# EasyEDA Pro project 小张FOC-STM32G431CBU6.epro, board PCB5_1
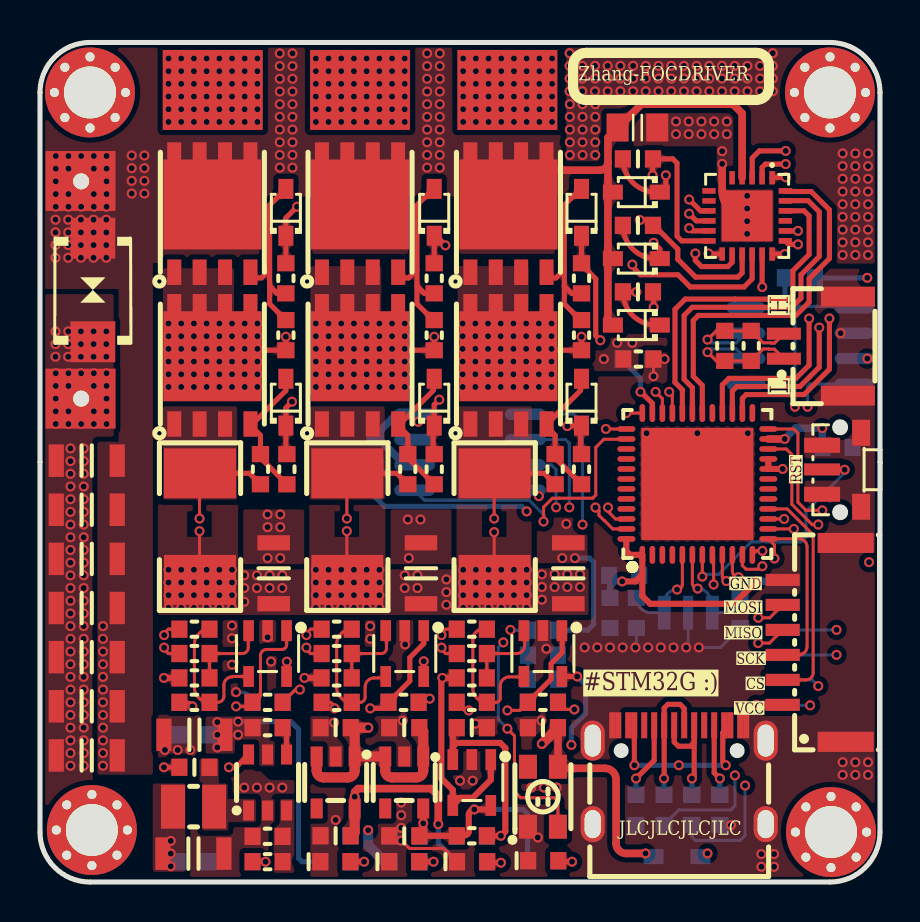
[diagram p11: board, top side]
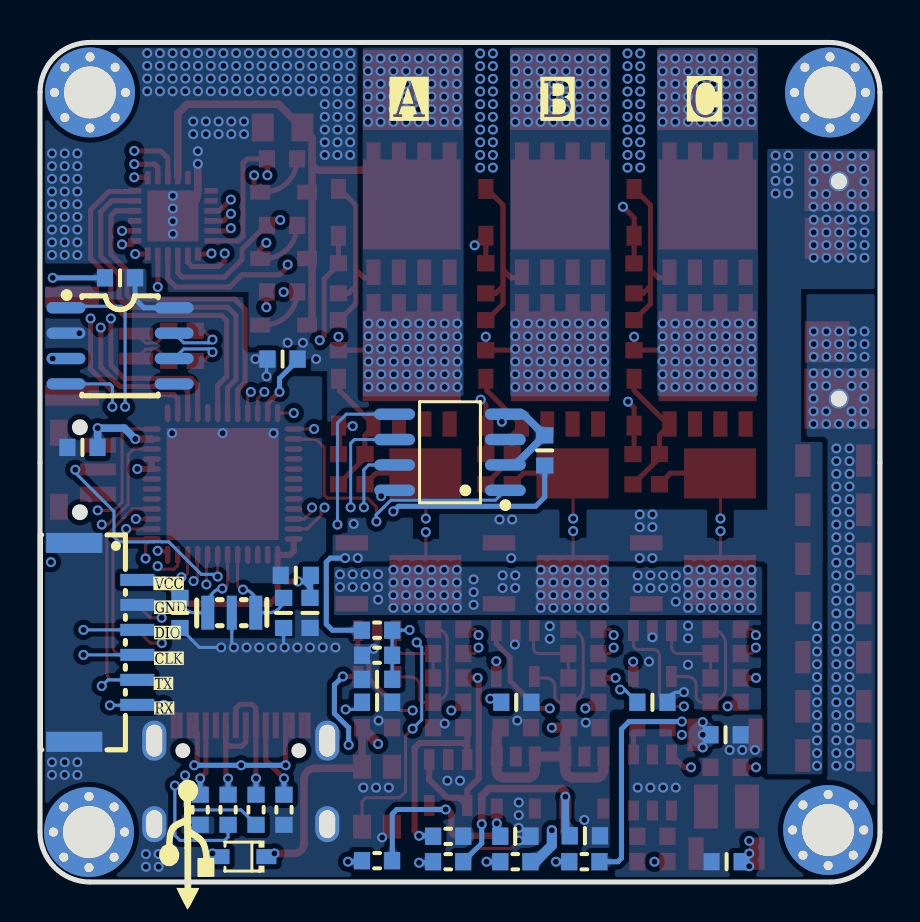
[diagram p12: board, bottom side, seen from below]

Outline 42 x 42 mm; copper layers: Top Layer, Inner1, Inner2, Bottom Layer. Coordinates in mm from the lower left corner of the outline.
Outline path: 0,39.5 0,2.5 arc(0.73,0.73) 2.5,0 39.5,0 arc(41.27,0.73) 42,2.5 42,39.5 arc(41.27,41.27) 39.5,42 2.5,42 arc(0.73,41.27) 0,39.5
Stack: Top Layer 0.035mm 外层铜厚1oz / Dielectric1 0.2104mm 7628 RC49% 8.6mil / Inner1 0.0152mm 内层铜厚 / Dielectric2 1.065mm 1.1mm H/HOZ Copper / Inner2 0.0152mm 内层铜厚 / Dielectric3 0.2104mm 7628 RC49% 8.6mil / Bottom Layer 0.035mm 外层铜厚1oz

## Design rules (mm)
net FDCAN_L: DP1
net FDCAN_H: DP1
net USB-DM: DP3
net USB-DP: DP3
net FDCAN_RX: DP2
net FDCAN_TX: DP2
template: 自定义配置
spacing copperThickness1oz (default): track to track 0.102, other pairs 0.102 to 0.127
spacing copperThickness2oz: track to track 0.203, other pairs 0.152 to 0.3
track width copperThickness1oz (default): min 0.127, default 0.152, max 2.54
track width copperThickness2oz: min 0.203, default 0.254, max 2.54
differential pair differentialPair (default): width min 0.127, default 0.152, max 2.54; gap min 0.152, default 0.152
via viaSize (default): diameter min 0.399, default 0.5, max 10; hole min 0.3, default 0.3, max 6.299

## Placement (name value [footprint] x y rotation side)
C4  100nF  [C0603_SMALL]  7.72 5.74 180 top
C16  10uF  [C1206_SMALL]  19.05 15.44 270 top
C17  10uF  [C1206_SMALL]  26.42 15.44 270 top
C18  10uF  [C1206_SMALL]  2.34 16.17 180 top
C19  10uF  [C1206_SMALL]  2.34 13.71 180 top
C20  10uF  [C1206_SMALL]  2.34 8.79 180 top
C21  10uF  [C1206_SMALL]  2.34 18.62 180 top
C22  10uF  [C1206_SMALL]  2.34 11.25 180 top
C23  10uF  [C1206_SMALL]  2.34 6.33 180 top
C24  10uF  [C1206_SMALL]  2.34 21.08 180 top
C25  10uF  [C1206_SMALL]  11.68 15.44 270 top
C26  100nF  [C0603_SMALL]  7.72 7.37 180 bottom
C30  100nF  [C0603_SMALL]  38 30.23 0 bottom
C31  100nF  [C0603_SMALL]  29.87 26.16 180 bottom
C32  100nF  [C0603_SMALL]  28.5 13.46 90 bottom
C33  100nF  [C0603_SMALL]  29.21 15.34 180 bottom
C34  100nF  [C0603_SMALL]  39.88 21.74 180 bottom
C35  20pF  [C0603_SMALL]  29.82 13.46 270 bottom
C36  20pF  [C0603_SMALL]  35 13.46 90 bottom
C37  1uF  [C0603_SMALL]  29.9 29.53 0 top
C40  1uF  [C0603_SMALL]  29.9 32.85 0 top
C43  1uF  [C0603_SMALL]  29.9 36.18 0 top
C45  1nF  [C0603_SMALL]  11.38 8.99 0 bottom
C46  1nF  [C0603_SMALL]  18.19 8.99 0 bottom
C52  1nF  [C0603_SMALL]  25.15 8.99 0 bottom
C53  1nF  [C0603_SMALL]  25.15 10.14 180 bottom
C54  10nF  [C0603_SMALL]  21.59 7.72 180 top
C59  1uF  [C0603_SMALL]  14.78 7.72 0 top
C60  1uF  [C0603_SMALL]  14.78 2.31 0 top
C61  1uF  [C0603_SMALL]  18.21 7.72 0 top
C62  1uF  [C0603_SMALL]  18.21 2.31 0 top
C64  100nF  [C0603_SMALL]  16.76 21.59 90 bottom
C65  100nF  [C0603_SMALL]  25.15 7.72 180 top
C66  10uF  [C1206_SMALL]  7.72 7.37 180 top
C67  10uF  [C1206_SMALL]  7.67 1.42 0 top
C68  100nF  [C0603_SMALL]  7.67 1.02 0 bottom
C70  10uF  [C0805_SMALL]  29.87 37.74 180 top
C71  100nF  [C0603_SMALL]  14.75 2.31 180 bottom
C72  100nF  [C0603_SMALL]  18.24 2.29 180 bottom
CN5  WAFER-GH1.25-6PWB  [CONN-SMD_6P-P1.25_XUNPU_WAFER-GH1.25-6PWB]  38.71 11.99 90 top
CN6  X1251WRS-02HF-LPSW  [CONN-SMD_2P-P1.25_X1251WRS-02HF-LPSW]  38.8 26.81 90 top
CN7  WAFER-GH1.25-6PWB  [CONN-SMD_6P-P1.25_XUNPU_WAFER-GH1.25-6PWB]  38.71 11.99 270 bottom
D1  SMBJ28CA  [SMB_L4.6-W3.6-LS5.3-BI]  2.64 29.62 270 top
D8  B16WS  [SOD-323_L1.8-W1.3-LS2.5-RD]  29.82 27.86 180 top
D9  B16WS  [SOD-323_L1.8-W1.3-LS2.5-RD]  29.82 31.19 180 top
D10  B16WS  [SOD-323_L1.8-W1.3-LS2.5-RD]  29.82 34.51 180 top
D11  B16WS  [SOD-323_L1.8-W1.3-LS2.5-RD]  12.29 33.5 90 top
D14  B16WS  [SOD-323_L1.8-W1.3-LS2.5-RD]  12.29 24 90 top
D15  B16WS  [SOD-323_L1.8-W1.3-LS2.5-RD]  19.71 24 90 top
D16  B16WS  [SOD-323_L1.8-W1.3-LS2.5-RD]  27.08 24 90 top
D17  B16WS  [SOD-323_L1.8-W1.3-LS2.5-RD]  19.71 33.5 90 top
D18  B16WS  [SOD-323_L1.8-W1.3-LS2.5-RD]  27.08 33.5 90 top
D19  B16WS  [SOD-323_L1.8-W1.3-LS2.5-RD]  31.85 1.27 0 bottom
L1  4.7uH  [IND-SMD_L2.5-W2.0]  7.68 3.77 0 top
L3  NCD0603R1  [LED0603_S]  17.58 1.02 180 top
L4  NCD0603R1  [LED0603_S]  14.14 1.02 180 top
L5  NCD0603R1  [LED0603_S]  24.54 1.07 180 top
L6  NCD0603R1  [LED0603_S]  20.98 1.02 180 top
LED1  XL-3528RGBW-WS2812B  [LED-SMD_4P-L3.5-W2.8-BR-1]  25.15 4.27 270 top
NOREF  -  [Pad_e194]  8.64 39.62 90 top
NOREF#2  -  [Pad_e181]  2.03 24.18 0 top
NOREF#3  -  [Pad_e196]  23.37 39.62 90 top
NOREF#4  -  [Pad_e195]  16 39.62 90 top
NOREF#5  -  [Pad_e1682]  2.06 24.18 0 top
NOREF#6  -  [Pad_e70]  2.06 35.05 0 top
NOREF#7  -  [Pad_e180]  2.03 35.07 0 top
Q7  CSD18540Q5B  [VSON-CLIP-8_L5.0-W6.0-P1.27-BL]  8.62 33.51 0 top
Q8  CSD18540Q5B  [VSON-CLIP-8_L5.0-W6.0-P1.27-BL]  8.62 25.91 0 top
Q9  CSD18540Q5B  [VSON-CLIP-8_L5.0-W6.0-P1.27-BL]  16 33.51 0 top
Q10  CSD18540Q5B  [VSON-CLIP-8_L5.0-W6.0-P1.27-BL]  16 25.91 0 top
Q11  CSD18540Q5B  [VSON-CLIP-8_L5.0-W6.0-P1.27-BL]  23.42 25.91 0 top
Q12  CSD18540Q5B  [VSON-CLIP-8_L5.0-W6.0-P1.27-BL]  23.42 33.51 0 top
R2  52.3kΩ  [R0603_SMALL]  11.38 1.02 0 top
R4  10kΩ  [R0603_SMALL]  11.38 2.29 180 top
R6  62R  [R0603_SMALL]  35.56 26.82 90 top
R7  62R  [R0603_SMALL]  34.24 26.82 90 top
R11  0Ω  [R0603_SMALL]  29.92 26.16 0 top
R14  4.7kΩ  [R0603_SMALL]  33.99 3.62 90 bottom
R15  22Ω  [R0603_SMALL]  31.2 3.61 270 bottom
R16  4.7kΩ  [R0603_SMALL]  29.8 3.61 270 bottom
R17  22Ω  [R0603_SMALL]  32.59 3.61 270 bottom
R20  100kΩ  [R0603_SMALL]  7.72 8.99 0 top
R21  100kΩ  [R0603_SMALL]  14.83 8.99 0 top
R27  22Ω  [R0603_SMALL]  11.38 8.99 180 top
R28  22Ω  [R0603_SMALL]  18.18 8.99 180 top
R29  100kΩ  [R0603_SMALL]  7.72 10.21 180 top
R33  100kΩ  [R0603_SMALL]  21.59 8.99 0 top
R38  22Ω  [R0603_SMALL]  25.15 8.99 180 top
R41  1mΩ  [RES-SMD_L6.4-W3.2_LR2512D-3W-1MR]  8 17.78 90 top
R42  1mΩ  [RES-SMD_L6.4-W3.2_LR2512D-3W-1MR]  15.37 17.78 90 top
R43  1mΩ  [RES-SMD_L6.4-W3.2_LR2512D-3W-1MR]  22.73 17.78 90 top
R44  11kΩ  [R0603_SMALL]  25.15 12.6 0 bottom
R48  1kΩ  [R0603_SMALL]  25.15 11.35 0 bottom
R57  10kΩ  [R0603_SMALL]  21.59 2.29 0 bottom
R59  22Ω  [R0603_SMALL]  12.29 30.2 270 top
R62  10kΩ  [R0603_SMALL]  12.29 27.36 90 top
R67  10kΩ  [R0603_SMALL]  11.02 20.65 90 top
R68  22Ω  [R0603_SMALL]  12.34 20.65 270 top
R71  2kΩ  [R0603_SMALL]  7.72 12.65 0 top
R72  2kΩ  [R0603_SMALL]  7.72 11.43 0 top
R73  100kΩ  [R0603_SMALL]  21.59 10.21 180 top
R74  2kΩ  [R0603_SMALL]  21.59 12.65 0 top
R75  2kΩ  [R0603_SMALL]  21.59 11.43 0 top
R76  100kΩ  [R0603_SMALL]  14.83 10.21 180 top
R77  2kΩ  [R0603_SMALL]  14.83 12.65 0 top
R78  2kΩ  [R0603_SMALL]  14.83 11.43 0 top
R80  10kΩ  [R0603_SMALL]  21.59 2.31 180 top
R81  10kΩ  [R0603_SMALL]  18.39 20.65 90 top
R82  22Ω  [R0603_SMALL]  19.71 20.65 270 top
R83  10kΩ  [R0603_SMALL]  25.76 20.65 90 top
R84  22Ω  [R0603_SMALL]  27.08 20.65 270 top
R85  10kΩ  [R0603_SMALL]  19.71 27.36 90 top
R86  22Ω  [R0603_SMALL]  19.71 30.2 270 top
R87  10kΩ  [R0603_SMALL]  27.08 27.36 90 top
R88  22Ω  [R0603_SMALL]  27.08 30.2 270 top
R90  100kΩ  [R0603_SMALL]  11.38 7.72 0 top
R91  4.7kΩ  [R0603_SMALL]  18.24 1.02 0 bottom
R92  4.7kΩ  [R0603_SMALL]  14.78 1.02 0 bottom
R93  4.7kΩ  [R0603_SMALL]  25.15 1.07 0 bottom
R94  4.7kΩ  [R0603_SMALL]  21.59 1.02 0 bottom
SW1  SKRTLAE010  [KEY-SMD_SKRTLAE010]  40.08 20.62 90 top
TP1  -  [M2.5螺丝孔]  2.5 39.5 0 top
TP2  -  [M2.5螺丝孔]  2.59 2.6 0 top
TP3  -  [M2.5螺丝孔]  39.55 2.5 0 top
TP4  -  [M2.5螺丝孔]  39.5 39.5 0 top
U1  STM32G431CBU6U  [UFQFPN-48_L7.0-W7.0-P0.50-BL-EP5.6]  32.87 19.91 0 top
U2  LP5907QMFX-3.3Q1  [SOT-23-5_L3.0-W1.7-P0.95-LS2.8-BR]  18.21 4.98 90 top
U3  XC6210B332MR  [SOT-23-5_L3.0-W1.7-P0.95-LS2.8-BR]  14.78 4.98 90 top
U4  RY8411  [SOT-23-6_L2.9-W1.6-P0.95-LS2.8-BR]  11.38 4.98 270 top
U5  TJA1050T/CM,118  [SOIC-8_L5.0-W4.0-P1.27-LS6.0-BL]  38 26.82 270 bottom
U7  FD6288Q  [QFN-24_L4.0-W4.0-P0.50-BL-EP2.6]  35.36 33.33 180 top
U12  RS721XF  [TSOT-23-5_L2.9-W1.6-P0.95-LS2.8-BL]  11.38 11.43 180 top
U13  RS721XF  [TSOT-23-5_L2.9-W1.6-P0.95-LS2.8-BL]  18.24 11.43 180 top
U14  RS721XF  [TSOT-23-5_L2.9-W1.6-P0.95-LS2.8-BL]  25.15 11.43 180 top
U16  MT6816CT-ACD  [SOP-8_L5.0-W4.0-P1.27-LS6.0-BL]  21.5 21.5 90 bottom
U17  RS721XF  [TSOT-23-5_L2.9-W1.6-P0.95-LS2.8-BL]  21.59 4.98 180 top
USBC1  TYPE-C-31-M-12  [USB-C_SMD-TYPE-C-31-M-12]  31.96 5.37 0 top
X1  20MHz  [OSC-SMD_3P-L3.2-W1.3-P1.2-L]  32.41 13.47 0 bottom

## Footprints (pads in the part's own frame, mm; a bottom-side part is the same pattern mirrored in y, then rotated)
C0603_SMALL
  rect 0.806x0.864 smd: 1(-0.753,0) 2(0.753,0)
C0805_SMALL
  rect 1.1x1.399 smd: 1(-0.991,0) 2(0.991,0)
C1206_SMALL
  rect 0.762x1.625 smd: 1(-1.524,0) 2(1.524,0)
CONN-SMD_2P-P1.25_X1251WRS-02HF-LPSW
  rect 0.6x1.7 smd: 1(-0.625,1.6) 2(0.625,1.6)
  rect 1x2.7 smd: 3(2.475,-1.6) 4(-2.475,-1.6)
CONN-SMD_6P-P1.25_XUNPU_WAFER-GH1.25-6PWB
  rect 0.6x1.7 smd: 1(-3.125,1.575) 2(-1.875,1.575) 3(-0.625,1.575) 4(0.625,1.575) 5(1.875,1.575) 6(3.125,1.575)
  rect 1x2.8 smd: 7(4.975,-1.575) 8(-4.975,-1.575)
IND-SMD_L2.5-W2.0
  rect 1.2x2.2 smd: 1(1.028,0) 2(-1.028,0)
KEY-SMD_SKRTLAE010
  rect 0.75x1.8 smd: 1(-1.225,0.975) 3(1.225,0.975)
  rect 0.6x1.8 smd: 2(0.015,0.975)
  rect 1.3x0.9 smd: 4(-1.85,-0.975) 5(1.85,-0.975)
LED0603_S
  rect 0.806x0.864 smd: 1(-1.381,-0.001) 2(0.126,-0.001)
LED-SMD_4P-L3.5-W2.8-BR-1
  rect 1.2x0.9 smd: 1(1.5,-0.75) 2(1.5,0.75) 3(-1.5,0.75) 4(-1.5,-0.75)
M2.5螺丝孔
  round 0.635 hole 0.457: (-1.778,0) (-1.257,1.257) (-1.257,-1.257) (0,1.778) (0,-1.778) (1.257,1.257) (1.257,-1.257) (1.778,0)
  round 4.5 hole 2.6: 0(0,0)
OSC-SMD_3P-L3.2-W1.3-P1.2-L
  rect 0.65x1.7 smd: 1(-1.2,0) 3(1.2,0)
  rect 0.5x1.7 smd: 2(0,0)
Pad_e70
  round 1 hole 0.8: 1(0,0)
Pad_e180
  rect 3.5x3 smd: 1(0,0)
Pad_e181
  rect 3.5x3 smd: 2(0,0)
Pad_e194
  rect 4x5 smd: 1(0,0)
Pad_e195
  rect 4x5 smd: 2(0,0)
Pad_e196
  rect 4x5 smd: 3(0,0)
Pad_e1682
  round 1 hole 0.8: 1(0,0)
QFN-24_L4.0-W4.0-P0.50-BL-EP2.6
  rect 0.28x0.665 smd: 1(-1.25,-1.907) 2(-0.75,-1.907) 3(-0.25,-1.907) 4(0.25,-1.907) 5(0.75,-1.907) 6(1.25,-1.907) 13(1.25,1.907) 14(0.75,1.907) 15(0.25,1.907) 16(-0.25,1.907) 17(-0.75,1.907) 18(-1.25,1.907)
  rect 0.665x0.28 smd: 7(1.907,-1.25) 8(1.907,-0.75) 9(1.907,-0.25) 10(1.907,0.25) 11(1.907,0.75) 12(1.907,1.25) 19(-1.907,1.25) 20(-1.907,0.75) 21(-1.907,0.25) 22(-1.907,-0.25) 23(-1.907,-0.75) 24(-1.907,-1.25)
  rect 2.55x2.55 smd: 25(0,0)
R0603_SMALL
  rect 0.806x0.864 smd: 1(-0.753,0) 2(0.753,0)
RES-SMD_L6.4-W3.2_LR2512D-3W-1MR
  rect 2.5x3.6 smd: 1(-2.667,0) 2(2.667,0)
SMB_L4.6-W3.6-LS5.3-BI
  rect 2.047x2.241 smd: 1(-2.591,0) 2(2.591,0)
SOD-323_L1.8-W1.3-LS2.5-RD
  rect 1x0.75 smd: 1(-1.173,0) 2(1.173,0)
SOIC-8_L5.0-W4.0-P1.27-LS6.0-BL
  oval 0.569x1.95 smd: 1(-1.905,-2.705) 2(-0.635,-2.705) 3(0.635,-2.705) 4(1.905,-2.705) 5(1.905,2.705) 6(0.635,2.705) 7(-0.635,2.705) 8(-1.905,2.705)
SOP-8_L5.0-W4.0-P1.27-LS6.0-BL
  oval 0.574x2.035 smd: 1(-1.905,-2.768) 2(-0.635,-2.768) 3(0.635,-2.768) 4(1.905,-2.768) 5(1.905,2.768) 6(0.635,2.768) 7(-0.635,2.768) 8(-1.905,2.768)
SOT-23-5_L3.0-W1.7-P0.95-LS2.8-BR
  rect 1x0.6 smd: 1(1.3,-0.95) 2(1.3,0) 3(1.3,0.95) 4(-1.3,0.95) 5(-1.3,-0.95)
SOT-23-6_L2.9-W1.6-P0.95-LS2.8-BR
  rect 1x0.55 smd: 1(1.4,-0.95) 2(1.4,0) 3(1.4,0.95) 4(-1.4,0.95) 5(-1.4,0) 6(-1.4,-0.95)
TSOT-23-5_L2.9-W1.6-P0.95-LS2.8-BL
  rect 0.532x1.045 smd: 1(-0.95,-1.147) 2(0,-1.147) 3(0.95,-1.147) 4(0.95,1.147) 5(-0.95,1.147)
UFQFPN-48_L7.0-W7.0-P0.50-BL-EP5.6
  oval 0.28x0.9 smd: 1(-2.751,-3.547) 2(-2.251,-3.547) 3(-1.75,-3.547) 4(-1.25,-3.547) 5(-0.75,-3.547) 6(-0.249,-3.547) 7(0.249,-3.547) 8(0.75,-3.547) 9(1.25,-3.547) 10(1.75,-3.547) 11(2.251,-3.547) 12(2.751,-3.547) 25(2.751,3.547) 26(2.251,3.547) 27(1.75,3.547) 28(1.25,3.547) 29(0.75,3.547) 30(0.249,3.547) 31(-0.249,3.547) 32(-0.75,3.547) 33(-1.25,3.547) 34(-1.75,3.547) 35(-2.251,3.547) 36(-2.751,3.547)
  oval 0.9x0.28 smd: 13(3.547,-2.75) 14(3.547,-2.25) 15(3.547,-1.75) 16(3.547,-1.25) 17(3.547,-0.75) 18(3.547,-0.25) 19(3.547,0.25) 20(3.547,0.75) 21(3.547,1.25) 22(3.547,1.75) 23(3.547,2.25) 24(3.547,2.75) 37(-3.547,2.751) 38(-3.547,2.251) 39(-3.547,1.75) 40(-3.547,1.25) 41(-3.547,0.75) 42(-3.547,0.249) 43(-3.547,-0.249) 44(-3.547,-0.75) 45(-3.547,-1.25) 46(-3.547,-1.75) 47(-3.547,-2.251) 48(-3.547,-2.751)
  rect 5.6x5.6 smd: 49(0,0)
USB-C_SMD-TYPE-C-31-M-12
  oval 1.2x2 hole 0.8x1.6: 0(-4.325,1.706) 1(4.325,1.706)
  oval 1.2x1.8 hole 0.8x1.4: 2(4.325,-2.474) 3(-4.325,-2.474)
  rect 0.3x1.3 smd: A1(-3.35,2.474) A4(-2.55,2.474) A5(-1.25,2.474) A6(-0.25,2.474) A7(0.25,2.474) A8(1.25,2.474) A9(2.55,2.474) A12(3.35,2.474) B1(3.05,2.474) B4(2.25,2.474) B5(1.75,2.474) B6(0.75,2.474) B7(-0.75,2.474) B8(-1.75,2.474) B9(-2.25,2.474) B12(-3.05,2.474)
VSON-CLIP-8_L5.0-W6.0-P1.27-BL
  rect 0.7x1.27 smd: 1(-1.904,-3) 2(-0.636,-3) 3(0.636,-3) 4(1.906,-3)
  rect 0.7x1 smd: 5(1.904,3) 6(0.634,3) 7(-0.636,3) 8(-1.906,3)
  rect 4.9x4.5 smd: 8(-0.001,0.39)

## Nets
As in the schematic, except:
12V: C16.1 C17.1 C18.1 C19.1 C20.1 C21.1 C22.1 C23.1 C24.1 C25.1 C26.1 C66.1 C70.2 D1.1 D8.2 D9.2 D10.2 NOREF#6.1 NOREF#7.1 Q7.5 Q7.6 Q7.7 Q7.8 Q9.5 Q9.6 Q9.7 Q9.8 Q12.5 Q12.6 Q12.7 Q12.8 R44.2 R90.1 R92.1 U4.5 U7.4
PGND: C16.2 C17.2 C18.2 C19.2 C20.2 C21.2 C22.2 C23.2 C24.2 C25.2 C26.2 C66.2 C67.2 C68.2 C70.1 D1.2 NOREF#2.2 NOREF#5.1 R4.2 R11.1 R41.1 R42.1 R43.1 R71.1 R74.1 R77.1 U4.2 U7.6 U7.25
SH_A: C37.2 NOREF#3.3 Q11.5 Q11.6 Q11.7 Q11.8 Q12.1 Q12.2 Q12.3 R87.1 U7.18
SH_B: C40.2 NOREF#4.2 Q9.1 Q9.2 Q9.3 Q10.5 Q10.6 Q10.7 Q10.8 R85.1 U7.15
SH_C: C43.2 NOREF.1 Q7.1 Q7.2 Q7.3 Q8.5 Q8.6 Q8.7 Q8.8 R62.1 U7.12

Pads without a net: LED1 4; TP1 0; TP2 0; TP3 0; TP4 0; U1 3 4 17 18 19 25 29 39 40 41 42 43 44 45; U2 4; U3 4; U5 5; U7 5 7 8 21; U16 3; USBC1 A8 B8

## Via types
v1: diameter 0.5, hole 0.299, Top Layer to Bottom Layer, 915 vias

## Routing (per net, layer and track width the routed paths; a pad name or vN(x,y) marks a point on that pad's centre or on a via; arc(x,y) is an arc through that point)
5V: length 96.5
  Top Layer w0.254: R2.1 v1(11.28,1.02)
  Top Layer w0.381: 25.9,7.71 25.9,5.77 arc(25.9,5.77) LED1.3 arc(25.92,5.71) 25.97,5.69 28.25,5.69 arc(28.64,5.53) 28.8,5.13 28.8,1.93 arc(28.95,1.58) 29.3,1.43 v1(30.28,1.43)
  Top Layer w0.508: v1(25.09,6.91) 25.9,7.71 25.9,7.72 ; U3.3 13.83,5.57 arc(13.93,5.33) 14.17,5.23 15.39,5.23 arc(15.63,5.33) 15.73,5.57 U3.1 ; U3.1 U2.3 17.26,5.57 arc(17.36,5.33) 17.6,5.23 18.82,5.23 arc(19.06,5.33) 19.16,5.57 U2.1 19.16,7.53 arc(19.1,7.66) 18.97,7.72 ; U3.1 15.73,7.53 C59.2 v1(16.41,7.72)
  Inner1 w0.305: v1(41.36,26.19) 41.45,26.1 v1(41.45,16)
  Inner2 w0.254: v1(6.54,0.79) 6.78,1.03 11.26,1.03 v1(11.28,1.02) ; v1(41.36,26.19) v1(41.36,30.23)
  Inner2 w0.305: v1(30.28,1.43) 30.84,0.86 34.8,0.86 35.25,1.32 35.25,3.86 35.61,4.22 37.29,4.22 41.45,8.38 v1(41.45,16)
  Inner2 w0.508: v1(25.09,6.91) 16.87,6.91 16.41,6.45 ; 16.41,6.45 v1(16.41,7.72) ; 16.41,6.45 16.41,2.84 arc(16.4,2.72) 16.37,2.6 arc(16.08,2.21) 15.62,2.06 v1(6.54,2.06)
  Bottom Layer w0.254: v1(41.36,30.23) C30.2
  Bottom Layer w0.508: v1(16.41,2.59) 16.41,1.83 17.22,1.02 R91.1
  vias: v1(6.54,1.42)
12V: length 43.9
  Top Layer w0.381: 28.4,36.03 28.4,37.24 30.07,38.91 34.65,38.91 35.11,38.45 U7.4 ; 28.4,36.03 28.4,30.94 ; 28.4,36.03 arc(28.28,35.73) 27.98,35.61 25.22,35.61 arc(23.91,35.07) 23.37,33.76 ; 28.4,30.94 28.4,28.11 arc(28.47,27.93) D8.2 ; 28.4,30.94 arc(28.47,31.12) D9.2
  Bottom Layer w0.254: v1(9.91,8.03) 12.55,8.03 12.93,7.65 12.93,1.2 13.11,1.02 R92.1 ; v1(26.75,16.2) 27.48,16.2 27.69,16 27.69,12.9 27.38,12.6 25.9,12.6
  vias: v1(0.79,36.32) v1(0.79,35.69) v1(0.79,35.05) v1(0.79,34.42) v1(0.79,33.78) v1(0.77,33.13) v1(0.77,32.5) v1(0.77,31.86) v1(0.77,31.23) v1(1.42,36.32) v1(1.42,35.69) v1(1.42,34.42) v1(1.42,33.78) v1(1.41,33.13) v1(1.41,32.5) v1(1.41,31.86) v1(1.41,31.23) v1(2.04,33.13) v1(2.04,32.5) v1(2.04,31.86) v1(2.04,31.23) v1(2.06,36.32) v1(2.06,33.78) v1(2.69,36.32) v1(2.69,35.69) v1(2.69,34.42) v1(2.69,33.78) v1(2.68,33.13) v1(2.68,32.5) v1(2.68,31.86) v1(2.68,31.23) v1(3.15,12.8) v1(3.15,12.17) v1(3.15,11.53) v1(3.15,10.9) v1(3.15,10.26) v1(3.15,9.63) v1(3.15,8.99) v1(3.15,8.36) v1(3.15,7.72) v1(3.15,7.09) v1(3.15,6.45) v1(3.15,5.82) v1(3.33,36.32) v1(3.33,35.69) v1(3.33,35.05) v1(3.33,34.42) v1(3.33,33.78) v1(3.31,33.13) v1(3.31,32.5) v1(3.31,31.86) v1(3.31,31.23) v1(4.59,36.35) v1(4.59,35.71) v1(4.59,35.08) v1(4.59,34.44) v1(5.22,36.35) v1(5.22,35.71) v1(5.22,35.08) v1(5.22,34.44) v1(8.86,8) v1(8.86,7.37) v1(8.86,6.73) v1(9.91,7.37) v1(11.38,18.39) v1(11.38,17.75) v1(11.38,16.2) v1(11.99,41.45) v1(11.99,40.82) v1(11.99,40.18) v1(11.99,39.55) v1(11.99,38.91) v1(11.99,38.28) v1(11.99,37.64) v1(11.99,37.01) v1(11.99,36.37) v1(11.99,35.74) v1(12.01,18.39) v1(12.01,17.75) v1(12.01,16.2) v1(12.62,41.45) v1(12.62,40.82) v1(12.62,40.18) v1(12.62,39.55) v1(12.62,38.91) v1(12.62,38.28) v1(12.62,37.64) v1(12.62,37.01) v1(12.62,36.37) v1(12.62,35.74) v1(18.39,18.14) v1(18.44,16.2) v1(19.02,18.14) v1(19.35,41.45) v1(19.35,40.82) v1(19.35,40.18) v1(19.35,39.55) v1(19.35,38.91) v1(19.35,38.28) v1(19.35,37.64) v1(19.35,37.01) v1(19.35,36.37) v1(19.35,35.74) v1(19.99,41.45) v1(19.99,40.82) v1(19.99,40.18) v1(19.99,39.55) v1(19.99,38.91) v1(19.99,38.28) v1(19.99,37.64) v1(19.99,37.01) v1(19.99,36.37) v1(19.99,35.74) v1(26.11,16.2) v1(26.31,17.91)
AVCC: length 70.4
  Top Layer w0.254: v1(12.34,11.02) 12.34,10.21 ; v1(26.86,10.28) U14.5 ; v1(19.19,11.05) 19.19,10.28
  Top Layer w0.305: v1(37.13,20.66) U1.20 U1.21 ; 22.54,3.63 v1(21.71,3.63) arc(21.52,3.55) 21.44,3.35 21.44,2.54 arc(21.38,2.4) 21.23,2.34 ; U2.5 v1(19.16,2.94) 19.16,2.51 arc(19.1,2.37) 18.97,2.31 20.84,2.31
  Inner2 w0.254: v1(21.71,3.63) 26.24,3.63 26.67,4.06 26.67,6.76 v1(26.57,6.86) ; 17.46,11.02 v1(12.34,11.02) ; 17.46,11.02 17.72,11.28 17.72,19.55 18.85,20.68 37.12,20.68 v1(37.13,20.66) ; 17.46,11.02 19.17,11.02 v1(19.19,11.05) 26.1,11.05 v1(26.86,10.28)
  Bottom Layer w0.254: v1(26.57,6.86) 26.57,7.72 27.28,8.43 27.28,9.86 v1(26.86,10.28) ; v1(21.71,3.63) 24.16,3.63 24.38,3.4 24.38,1.08 R93.1
  Bottom Layer w0.381: C72.1 19.16,2.46 v1(19.16,2.94)
GND: length 31.7
  Top Layer w0.152: v1(18.06,2.07) 18.08,2.07 18.48,1.68 20.19,1.68 20.85,1.02 ; R11.2 v1(30.67,25.3)
  Inner1 w0.254: v1(30.33,22.45) 27.18,19.3 v1(24.94,19.3)
  Inner2 w0.254: v1(24.94,19.3) 24.33,18.69 v1(24.33,18.54)
  Bottom Layer w0.152: C35.2 29.82,11.79 v1(29.77,11.73) ; X1.2 32.41,11.84 v1(32.31,11.73) ; 35,12.71 34.03,11.73 v1(32.94,11.73) ; v1(30.67,25.3) 30.67,26.11 C31.1 ; v1(9.8,9.5) 10.12,9.5 arc(10.48,9.35) C45.1
  Bottom Layer w0.254: C30.1 37.25,29.17 36.8,28.73 U5.8 ; C64.1 16.76,19.25 17.22,18.8 24.08,18.8 v1(24.33,18.54)
  vias: v1(9.6,12.83) v1(9.6,12.19) v1(9.6,10.87) v1(11.38,12.24) v1(11.55,11.03) v1(14.71,7.98) v1(14.78,3.11) v1(16.51,12.8) v1(16.51,12.17) v1(18.14,8.08) v1(18.06,3.98) v1(18.06,3.34) v1(18.06,2.71) v1(18.26,11.88) v1(21,5.07) v1(21.63,5.07) v1(21.77,7.92) v1(24.56,4.72) v1(24.89,2.23) v1(25.07,8.08) v1(25.2,4.72) v1(25.32,11.67) v1(25.83,4.72) v1(27.23,11.73) v1(27.86,11.73) v1(28.5,11.73) v1(29.13,11.73) v1(30.4,11.73) v1(31.04,11.73) v1(31.23,26.16) v1(31.67,11.73) v1(32.87,22.46) v1(34.54,2.84) v1(35.39,22.45) v1(36.07,1.4) v1(36.07,0.76) v1(36.7,1.4) v1(36.7,0.76) v1(40.03,27.46) v1(40.13,5.99) v1(40.13,5.36) v1(40.77,5.99) v1(40.77,5.36) v1(41.4,5.99) v1(41.4,5.36)
PGND: length 38.4
  Top Layer w0.152: v1(6.21,12.35) 6.21,12.44 6.41,12.65 R71.1 ; v1(15.34,17.56) 15.34,15.14 R42.1 ; R77.1 13.52,12.65 13.32,12.44 v1(13.32,12.35) ; v1(7.98,17.56) 7.98,15.14 R41.1 ; R43.1 22.71,15.14 v1(22.71,17.5) ; 20.84,12.65 20.28,12.65 20.07,12.44 v1(20.07,12.35)
  Top Layer w0.381: v1(34.11,35.93) U7.6 34.11,34.57 arc(34.47,33.69) U7.25
  Inner2 w0.152: v1(7.98,17.56) 7.81,17.72 6.21,17.72 5.78,17.29 5.78,12.3 5.89,12.19 6.04,12.19 v1(6.21,12.35) ; v1(22.71,17.5) 22.5,17.72 20.08,17.72 19.65,17.29 19.65,12.3 19.76,12.19 19.91,12.19 v1(20.07,12.35) ; v1(15.34,17.56) 15.18,17.72 13.32,17.72 12.9,17.29 12.9,12.3 13,12.19 13.16,12.19 v1(13.32,12.35)
  vias: v1(0.77,27.55) v1(0.77,26.91) v1(0.77,26.28) v1(0.79,25.45) v1(0.79,24.82) v1(0.79,24.18) v1(0.79,23.55) v1(0.79,22.91) v1(1.41,27.55) v1(1.41,26.91) v1(1.41,26.28) v1(1.42,25.45) v1(1.42,24.82) v1(1.42,23.55) v1(1.42,22.91) v1(1.52,21.69) v1(1.52,21.06) v1(1.52,20.42) v1(1.52,19.79) v1(1.52,19.15) v1(1.52,18.52) v1(1.52,17.88) v1(1.52,17.25) v1(1.52,16.61) v1(1.52,15.98) v1(1.52,15.34) v1(1.52,14.71) v1(1.52,14.07) v1(1.52,13.44) v1(1.52,12.8) v1(1.52,12.17) v1(1.52,11.53) v1(1.52,10.9) v1(1.52,10.26) v1(1.52,9.63) v1(1.52,8.99) v1(1.52,8.36) v1(1.52,7.72) v1(1.52,7.09) v1(1.52,6.45) v1(1.52,5.82) v1(2.04,27.55) v1(2.04,26.91) v1(2.04,26.28) v1(2.06,25.45) v1(2.06,22.91) v1(2.18,21.69) v1(2.18,21.06) v1(2.18,20.42) v1(2.18,19.79) v1(2.18,19.15) v1(2.18,18.52) v1(2.18,17.88) v1(2.18,17.25) v1(2.18,16.61) v1(2.18,15.98) v1(2.18,15.34) v1(2.18,14.71) v1(2.18,14.07) v1(2.18,13.44) v1(2.18,12.8) v1(2.18,12.17) v1(2.18,11.53) v1(2.18,10.9) v1(2.18,10.26) v1(2.18,9.63) v1(2.18,8.99) v1(2.18,8.36) v1(2.18,7.72) v1(2.18,7.09) v1(2.18,6.45) v1(2.18,5.82) v1(2.68,27.55) v1(2.68,26.91) v1(2.68,26.28) v1(2.69,25.45) v1(2.69,24.82) v1(2.69,23.55) v1(2.69,22.91) v1(3.31,27.55) v1(3.31,26.91) v1(3.31,26.28) v1(3.33,25.45) v1(3.33,24.82) v1(3.33,24.18) v1(3.33,23.55) v1(3.33,22.91) v1(6.25,6.6) v1(6.43,15.62) v1(6.43,14.99) v1(6.43,14.35) v1(6.43,13.72) v1(6.88,6.6) v1(7.06,15.62) v1(7.06,14.99) v1(7.06,14.35) v1(7.06,13.72) v1(7.52,6.6) v1(7.7,15.62) v1(7.7,14.99) v1(7.7,14.35) v1(7.7,13.72) v1(8.33,15.62) v1(8.33,14.99) v1(8.33,14.35) v1(8.33,13.72) v1(8.97,15.62) v1(8.97,14.99) v1(8.97,14.35) v1(8.97,13.72) v1(9.6,15.62) v1(9.6,14.99) v1(9.6,14.35) v1(9.6,13.72) v1(10.21,15.34) v1(10.21,14.71) v1(10.21,14.02) v1(10.21,4.72) v1(10.85,15.34) v1(10.85,14.71) v1(10.85,4.72) v1(11.48,15.34) v1(11.48,14.71) v1(11.48,4.72) v1(12.12,15.34) v1(12.12,14.71) v1(12.12,4.72) v1(13.79,15.62) v1(13.79,14.99) v1(13.79,14.35) v1(13.79,13.72) v1(14.43,15.62) v1(14.43,14.99) v1(14.43,14.35) v1(14.43,13.72) v1(15.06,15.62) v1(15.06,14.99) v1(15.06,14.35) v1(15.06,13.72) v1(15.7,15.62) v1(15.7,14.99) v1(15.7,14.35) v1(15.7,13.72) v1(16.33,15.62) v1(16.33,14.99) v1(16.33,14.35) v1(16.33,13.72) v1(16.97,15.62) v1(16.97,14.99) v1(16.97,14.35) v1(16.97,13.72) v1(18.24,15.34) v1(18.24,14.71) v1(18.87,15.34) v1(18.87,14.71) v1(20.32,15.14) v1(20.32,14.5) v1(20.32,13.87) v1(21.16,15.62) v1(21.16,14.99) v1(21.16,14.35) v1(21.16,13.72) v1(21.79,15.62) v1(21.79,14.99) v1(21.79,14.35) v1(21.79,13.72) v1(22.43,15.62) v1(22.43,14.99) v1(22.43,14.35) v1(22.43,13.72) v1(23.06,15.62) v1(23.06,14.99) v1(23.06,14.35) v1(23.06,13.72) v1(23.7,15.62) v1(23.7,14.99) v1(23.7,14.35) v1(23.7,13.72) v1(24.33,15.62) v1(24.33,14.99) v1(24.33,14.35) v1(24.33,13.72) v1(25.09,15.39) v1(25.09,14.76) v1(25.09,14.12) v1(25.73,15.39) v1(25.73,14.76) v1(26.37,15.39) v1(26.37,14.76) v1(26.48,41.47) v1(26.48,40.83) v1(26.48,40.2) v1(26.48,39.56) v1(26.49,38.91) v1(26.49,38.28) v1(26.49,37.64) v1(26.49,37.01) v1(26.49,36.37) v1(27,15.39) v1(27,14.76) v1(27.11,41.47) v1(27.11,40.83) v1(27.11,40.2) v1(27.11,39.56) v1(27.13,38.91) v1(27.13,38.28) v1(27.13,37.64) v1(27.13,37.01) v1(27.13,36.37) v1(27.75,41.47) v1(27.75,40.83) v1(27.75,40.2) v1(27.75,39.56) v1(27.76,38.91) v1(27.76,38.28) v1(27.76,37.64) v1(27.76,37.01) v1(27.76,36.37) v1(28.19,26.16) v1(28.38,41.47) v1(28.38,40.83) v1(28.38,40.2) v1(28.38,39.56) v1(28.85,26.97) v1(29.02,41.47) v1(29.02,40.83) v1(29.02,40.2) v1(29.02,39.56) v1(29.62,26.97) v1(29.65,41.47) v1(29.65,40.83) v1(29.65,40.2) v1(29.65,39.56) v1(30.29,41.47) v1(30.29,40.83) v1(30.29,40.2) v1(30.29,39.56) v1(30.92,41.47) v1(30.92,40.83) v1(30.92,40.2) v1(30.92,39.56) v1(31.56,41.47) v1(31.56,40.83) v1(31.56,40.2) v1(31.56,39.56) v1(31.8,38.05) v1(31.8,37.41) v1(32.19,41.47) v1(32.19,40.83) v1(32.19,40.2) v1(32.19,39.56) v1(32.44,38.05) v1(32.44,37.41) v1(32.83,41.47) v1(32.83,40.83) v1(32.83,40.2) v1(32.83,39.56) v1(33.07,38.05) v1(33.07,37.41) v1(33.46,41.47) v1(33.46,40.83) v1(33.46,40.2) v1(33.46,39.56) v1(33.71,38.05) v1(33.71,37.41) v1(34.1,41.47) v1(34.1,40.83) v1(34.1,40.2) v1(34.1,39.56) v1(34.11,36.56) v1(34.34,38.05) v1(34.34,37.41) v1(34.73,41.47) v1(34.73,40.83) v1(34.73,40.2) v1(34.73,39.56) v1(35.37,41.47) v1(35.37,40.83) v1(35.37,40.2) v1(35.37,39.56) v1(35.36,34.33) v1(35.36,33.69) v1(35.36,33.06) v1(35.36,32.42) v1(36,41.47) v1(36,40.83) v1(36,40.2) v1(36,39.56) v1(36.64,41.47) v1(36.64,40.83) v1(36.64,40.2) v1(36.64,39.56) v1(40.13,36.45) v1(40.13,35.81) v1(40.13,35.18) v1(40.13,34.54) v1(40.13,33.91) v1(40.13,33.27) v1(40.13,32.64) v1(40.13,32) v1(40.13,31.37) v1(40.77,36.45) v1(40.77,35.81) v1(40.77,35.18) v1(40.77,34.54) v1(40.77,33.91) v1(40.77,33.27) v1(40.77,32.64) v1(40.77,32) v1(40.77,31.37) v1(41.4,36.45) v1(41.4,35.81) v1(41.4,35.18) v1(41.4,34.54) v1(41.4,33.91) v1(41.4,33.27) v1(41.4,32.64) v1(41.4,32) v1(41.4,31.37)
VBUS: length 20.5
  Top Layer w0.152: v1(36.12,15.8) 35.97,15.65 35.31,15.65 35.12,15.83 U1.11
  Inner2 w0.152: v1(36.12,15.8) 28.65,15.8 28.5,15.65 28.5,12.85 28.26,12.61 v1(23.52,12.61)
  Bottom Layer w0.152: 24.39,10.19 R44.1 23.53,12.6 v1(23.52,12.61)
VCC: length 109.1
  Top Layer w0.254: 30.02,24.54 30.62,23.95 30.62,23.46
  Top Layer w0.305: 29.32,17.16 29.31,17.15 29.31,16.56 29.51,16.37 U1.1 30.12,15.39 ; v1(35.81,15.04) 34.7,13.92 30.51,13.92 30.12,14.31 30.12,15.39 ; 30.12,15.39 29.77,15.04 v1(29.11,15.04)
  Top Layer w0.381: CN5.1 v1(35.81,8.86) ; v1(19.91,2.9) 19.91,4.32 19.56,4.67 15.9,4.67 15.73,4.51 U3.5 ; U1.23 v1(37.24,22.16)
  Top Layer w0.508: U3.5 15.73,2.51 arc(15.68,2.37) C60.2
  Inner2 w0.254: 35.31,8.36 35.31,14.53 v1(35.81,15.04)
  Inner2 w0.381: 27.99,21.79 36.87,21.79 v1(37.24,22.16) ; 27.99,21.79 25.65,21.79 24.42,23.03 v1(18.91,23.03) ; 27.99,21.79 27.56,22.22 27.56,24.05 27.99,24.49 29.99,24.49 v1(30.02,24.52) ; v1(19.91,2.9) 21.18,1.63 29.41,1.63 30.48,2.69 30.48,7.42 31.09,8.03 34.98,8.03 35.31,8.36 v1(35.81,8.86) 38.25,11.3 38.25,17.42 38.26,17.43 38.26,17.9 38.25,17.91 38.25,18.85 39.12,19.71 v1(39.12,22.71)
  Bottom Layer w0.254: v1(30.02,24.52) 30.02,25.2 29.12,26.1 C31.2 ; 20.84,1.02 19.91,1.94 v1(19.91,2.9)
  Bottom Layer w0.305: C33.2 28.5,15.3 28.5,14.78 ; 28.5,14.78 28.75,15.04 v1(29.11,15.04) ; 28.5,14.78 C32.2 ; v1(18.91,23.03) 18.91,23.23 U16.4
  Bottom Layer w0.381: U16.2 18.24,20.86 C64.2 17.83,23.41 U16.4 ; CN7.1 37.06,15.04 v1(35.81,15.04) ; v1(15.73,4.27) 15.73,2.54 C71.1 ; v1(37.24,22.16) 37.78,22.71 v1(39.12,22.71) 39.12,21.75 C34.2
FDCAN_H: length 6.6
  Top Layer w0.152: CN6.2 36.72,26.96 36.57,26.96 36.56,26.97 36.16,26.97 R6.2 R7.2 33.81,27.58 v1(33.38,27.14)
  Bottom Layer w0.152: U5.7 34.81,26.97 33.54,26.97 v1(33.38,27.14)
FDCAN_L: length 6.6
  Top Layer w0.152: v1(33.38,26.51) 33.81,26.07 35.56,26.07 36.16,26.67 36.43,26.67 36.44,26.65 36.72,26.65 CN6.1
  Bottom Layer w0.152: U5.6 34.81,26.67 33.54,26.67 v1(33.38,26.51)
FDCAN_RX: length 24.9
  Top Layer w0.152: U1.46 28.78,18.16 28.4,18.54 v1(28.4,18.74)
  Inner2 w0.152: v1(28.4,18.74) 28.24,18.9 28.24,19.45 28.35,19.56 30.46,19.56 30.57,19.45 30.57,19.15 30.68,19.05 30.97,19.05 31.08,19.15 31.08,19.45 31.18,19.56 31.48,19.56 31.58,19.45 31.58,19.15 31.69,19.05 31.98,19.05 32.09,19.15 32.09,19.45 32.2,19.56 32.49,19.56 32.6,19.45 32.6,19.15 32.71,19.05 33,19.05 33.11,19.15 33.11,19.45 33.22,19.56 33.51,19.56 33.62,19.45 33.62,19.15 33.72,19.05 34.02,19.05 34.12,19.15 34.12,19.45 34.23,19.56 34.52,19.56 34.63,19.45 34.63,19.15 34.74,19.05 35.03,19.05 35.14,19.15 35.14,19.45 35.25,19.56 35.54,19.56 35.65,19.45 35.65,19.15 35.75,19.05 36.05,19.05 36.16,19.15 36.16,19.45 36.26,19.56 36.56,19.56 36.66,19.45 36.66,19.18 36.77,19.07 37.06,19.07 37.17,19.18 37.17,19.45 37.28,19.56 37.93,19.56 38.21,19.84 38.21,23.61 v1(38.38,23.77)
  Bottom Layer w0.152: U5.4 38.51,24.92 38.38,24.79 v1(38.38,23.77)
FDCAN_TX: length 24.9
  Top Layer w0.152: U1.47 28.64,17.66 28.23,18.08 28.21,18.08 27.95,18.35 27.95,18.56 v1(27.77,18.74)
  Inner2 w0.152: v1(27.77,18.74) 27.93,18.9 27.93,19.58 28.22,19.86 37.8,19.86 37.91,19.97 37.91,23.61 v1(37.74,23.77)
  Bottom Layer w0.152: U5.1 40.63,28.8 37.95,28.8 37.74,28.6 v1(37.74,23.77)
GH_A: length 20.1
  Top Layer w0.254: v1(28.02,27.1) 27.79,27.33 27.79,30.17 27.08,30.89 R88.1 D18.1 ; U7.19 37.44,31.9 v1(37.9,31.9)
  Inner2 w0.254: v1(37.9,31.9) 37.9,28.66 37.49,28.25 29.16,28.25 v1(28.02,27.1)
GH_B: length 19.8
  Top Layer w0.254: 35.61,31.42 35.61,30.17 35.2,29.77 32.51,29.77 31.9,30.38 30.02,30.38 29.62,30.78 v1(29.62,30.89) ; D17.1 19.71,32.31 ; 19.71,32.31 19.81,32.31 v1(20.27,31.85) ; 19.71,32.31 R86.1
  Inner2 w0.254: v1(29.62,30.89) 28.65,31.85 v1(20.27,31.85)
GH_C: length 28.7
  Top Layer w0.254: U7.13 33.45,31.42 v1(33.43,31.44) ; 12.29,30.95 D11.1 12.29,33.22 v1(12.85,33.78)
  Inner2 w0.254: v1(12.85,33.78) 13.77,34.7 33.73,34.7 33.93,34.49 33.93,31.65 33.73,31.44 v1(33.43,31.44)
GL_A: length 18.6
  Top Layer w0.254: 32.47,32.71 32.6,32.57 33.45,32.57 ; 27.03,22.83 27.03,21.45 27.08,21.4 ; 27.03,22.83 D16.1 ; 27.03,22.83 26.39,22.83 v1(26.37,22.81)
  Inner2 w0.254: v1(26.37,22.81) 26.37,29.72 26.77,30.12 29.78,30.12 30.18,30.53 30.18,32.46 30.43,32.71 v1(32.46,32.71)
GL_B: length 27.2
  Top Layer w0.254: v1(32.46,33.43) 32.81,33.08 U7.10 ; R82.1 19.66,21.45 19.66,22.83 ; D15.1 19.71,23.88 v1(19.96,24.13)
  Inner2 w0.254: v1(19.96,24.13) 19.2,24.89 19.2,33.48 19.56,33.83 32,33.83 32.4,33.43 v1(32.46,33.43)
GL_C: length 33.2
  Top Layer w0.254: 32.46,34.14 33.03,33.57 33.45,33.57 ; R68.1 12.29,21.45 D14.1 12.29,23.72 v1(12.6,24.03)
  Inner2 w0.254: v1(12.6,24.03) 13.29,24.72 13.29,33.35 14.17,34.24 32.36,34.24 32.46,34.14
  vias: v1(32.46,34.14)
HIN1: length 17.1
  Top Layer w0.254: 37.26,33.57 37.27,33.58 38.2,33.58 38.46,33.33 38.46,31.39 37.64,30.58 37.64,29.36 37.44,29.16 34.74,29.16 34.74,29.16 32.26,29.16 31.75,28.65 31.75,24.99 32.12,24.63 U1.32
HIN2: length 17.9
  Top Layer w0.254: U7.23 37.28,34.09 38.41,34.09 38.96,33.53 38.96,31.29 38.05,30.38 38.05,29.21 37.59,28.75 32.61,28.75 32.21,28.35 32.21,25.15 32.62,24.73 U1.31
HIN3: length 18.6
  Top Layer w0.254: U1.30 33.12,24.85 32.66,25.3 32.66,28.09 32.92,28.35 37.79,28.35 38.46,29.01 38.46,30.17 39.47,31.19 39.47,33.63 38.56,34.54 37.29,34.54 37.26,34.57
IA: length 17.7
  Top Layer w0.152: 25.9,8.99 26.25,8.63 v1(26.72,8.63) ; U1.10 34.62,15.56 arc(34.71,15.34) v1(34.93,15.25)
  Inner2 w0.152: v1(26.72,8.63) 33.98,8.63 arc(34.63,8.9) 34.9,9.55 34.9,15.22 arc(34.91,15.24) v1(34.93,15.25)
  Bottom Layer w0.152: v1(26.72,8.63) 26.26,8.63 C52.2
IA+: length 16.3
  Top Layer w0.152: R43.2 22.71,20.42 v1(22.71,18.18) ; v1(20.07,11.73) 20.07,11.64 20.28,11.43 20.84,11.43
  Top Layer w0.254: R43.2 25.21,20.45 R83.1
  Inner2 w0.152: v1(20.07,11.73) 19.91,11.89 19.63,11.89 19.35,12.17 19.35,17.42 19.95,18.02 22.55,18.02 v1(22.71,18.18)
IB: length 23.1
  Top Layer w0.152: v1(19.49,9.17) 19.12,9.17 18.93,8.99 ; U1.9 34.12,15.31 arc(34.17,15.14) v1(34.32,15.06)
  Inner2 w0.152: v1(19.49,9.17) 33.51,9.17 arc(34.1,9.42) 34.34,10.01 34.34,15.03 arc(34.33,15.05) v1(34.32,15.06)
  Bottom Layer w0.152: v1(19.49,9.17) 19.12,9.17 C46.2
IB+: length 15.7
  Top Layer w0.152: R78.1 13.52,11.43 13.32,11.64 v1(13.32,11.73) ; v1(15.34,18.18) 15.34,20.42 R42.2
  Top Layer w0.254: R42.2 17.84,20.45 R81.1
  Inner2 w0.152: v1(13.32,11.73) 13.16,11.89 12.88,11.89 12.59,12.17 12.59,17.42 13.2,18.02 15.18,18.02 v1(15.34,18.18)
IC: length 29.5
  Top Layer w0.152: v1(33.68,14.88) 33.68,16.3 33.62,16.37 ; 12.13,8.99 12.77,9.63 v1(12.99,9.63)
  Inner2 w0.152: v1(33.68,14.88) 33.68,10.16 arc(33.52,9.78) 33.15,9.63 v1(12.99,9.63)
  Bottom Layer w0.152: C45.2 12.77,9.63 v1(12.99,9.63)
IC+: length 15.4
  Top Layer w0.152: v1(7.98,18.18) 7.98,20.42 R41.2 ; R72.1 6.41,11.43 6.21,11.64 v1(6.21,11.73)
  Top Layer w0.254: R41.2 10.47,20.45 R67.1
  Inner2 w0.152: v1(7.98,18.18) 7.81,18.02 6.08,18.02 5.48,17.42 5.48,12.17 5.77,11.89 6.04,11.89 v1(6.21,11.73)
LIN1: length 17.3
  Top Layer w0.254: v1(37.29,35.25) 36.63,35.25 36.61,35.23 ; v1(38.46,28.19) 38.46,25.86 37.79,25.2 34.44,25.2 34.12,24.87 U1.28
  Inner2 w0.254: v1(38.46,28.19) 38.46,35.05 38.25,35.25 v1(37.29,35.25)
LIN2: length 19.3
  Top Layer w0.254: v1(38.96,27.74) 38.96,25.76 38,24.79 34.85,24.79 34.62,24.56 U1.27 ; v1(37.29,35.92) 36.27,35.92 36.11,35.75 U7.2
  Inner2 w0.254: v1(38.96,27.74) 38.96,35.56 38.61,35.92 v1(37.29,35.92)
LIN3: length 21.4
  Top Layer w0.254: v1(39.47,28.19) 39.47,25.65 38.2,24.38 35.31,24.38 35.12,24.2 U1.26 ; 35.61,35.23 35.61,35.24 35.61,36.22 35.97,36.58 v1(37.29,36.58)
  Inner2 w0.254: v1(37.29,36.58) 39.06,36.58 39.47,36.17 v1(39.47,28.19)
NRST: length 12.4
  Top Layer w0.152: v1(40.23,20.62) 39.12,20.62 SW1.2 ; U1.7 v1(33.12,15.28)
  Bottom Layer w0.152: v1(33.12,15.28) 33.23,15.39 33.93,15.39 35.56,17.02 35.93,17.02 35.93,17.02 36.31,17.02 36.31,17.02 38.05,17.02 38.3,17.27 38.3,18.54 40.23,20.47 v1(40.23,20.62)
OSC_IN: length 5.2
  Top Layer w0.152: U1.5 32.12,14.9 arc(32.04,14.71) v1(31.85,14.63)
  Bottom Layer w0.152: v1(31.85,14.63) arc(31.4,14.44) 31.21,13.99 X1.1 30.56,13.47 arc(30.04,13.69) C35.1
OSC_OUT: length 5.2
  Top Layer w0.152: U1.6 32.62,14.95 arc(32.7,14.76) v1(32.89,14.68)
  Bottom Layer w0.152: 33.53,13.52 33.53,14.04 arc(33.34,14.49) v1(32.89,14.68) ; X1.3 34.26,13.47 arc(34.78,13.69) 35,14.22
REF: length 26.3
  Top Layer w0.305: R73.2 v1(20.12,10.21) 20.07,10.16 20.07,5.18 20.64,4.61 U17.4 21.03,4.22 21.64,4.22 22.54,5.12 U17.1 ; v1(13.22,10.21) 14.08,10.21 ; v1(6.2,10.21) R29.2
  Inner2 w0.305: v1(20.12,10.21) v1(13.22,10.21) v1(6.2,10.21)
SH_A: length 19.1
  Top Layer w0.254: 23.42,26.37 23.66,26.6 R87.1 v1(27.08,27.28) ; v1(30.68,28.75) 30.68,29.49 arc(30.67,29.52) C37.2 ; U7.18 v1(37.24,31.42)
  Inner2 w0.254: v1(27.08,27.28) 28.55,28.75 v1(30.68,28.75) 36.93,28.75 37.24,29.06 37.24,31.41 v1(37.24,31.42)
  vias: v1(21.13,27.94) v1(21.13,27.31) v1(21.13,26.67) v1(21.13,26.04) v1(21.13,25.4) v1(21.13,24.77) v1(21.16,41.2) v1(21.16,40.56) v1(21.16,39.93) v1(21.16,39.3) v1(21.16,38.66) v1(21.16,38.03) v1(21.79,41.2) v1(21.79,40.56) v1(21.79,39.93) v1(21.79,39.3) v1(21.79,38.66) v1(21.79,38.03) v1(21.77,27.94) v1(21.77,27.31) v1(21.77,26.67) v1(21.77,26.04) v1(21.77,25.4) v1(21.77,24.77) v1(22.43,41.2) v1(22.43,40.56) v1(22.43,39.93) v1(22.43,39.3) v1(22.43,38.66) v1(22.43,38.03) v1(22.4,27.94) v1(22.4,27.31) v1(22.4,26.67) v1(22.4,26.04) v1(22.4,25.4) v1(22.4,24.77) v1(23.04,27.94) v1(23.04,27.31) v1(23.04,26.67) v1(23.04,26.04) v1(23.04,25.4) v1(23.04,24.77) v1(23.06,41.2) v1(23.06,40.56) v1(23.06,39.93) v1(23.06,39.3) v1(23.06,38.66) v1(23.06,38.03) v1(23.7,41.2) v1(23.7,40.56) v1(23.7,39.93) v1(23.7,39.3) v1(23.7,38.66) v1(23.7,38.03) v1(23.67,27.94) v1(23.67,27.31) v1(23.67,26.67) v1(23.67,26.04) v1(23.67,25.4) v1(23.67,24.77) v1(24.33,41.2) v1(24.33,40.56) v1(24.33,39.93) v1(24.33,39.3) v1(24.33,38.66) v1(24.33,38.03) v1(24.31,27.94) v1(24.31,27.31) v1(24.31,26.67) v1(24.31,26.04) v1(24.31,25.4) v1(24.31,24.77) v1(24.94,27.94) v1(24.94,27.31) v1(24.94,26.67) v1(24.94,26.04) v1(24.94,25.4) v1(24.94,24.77) v1(24.97,41.2) v1(24.97,40.56) v1(24.97,39.93) v1(24.97,39.3) v1(24.97,38.66) v1(24.97,38.03) v1(25.6,41.2) v1(25.6,40.56) v1(25.6,39.93) v1(25.6,39.3) v1(25.6,38.66) v1(25.6,38.03) v1(25.58,27.94) v1(25.58,27.31) v1(25.58,26.67) v1(25.58,26.04) v1(25.58,25.4) v1(25.58,24.77)
SH_B: length 28.4
  Top Layer w0.254: 16.05,26.37 16.29,26.6 R85.1 v1(19.71,27.28) ; v1(29.99,33.12) 30.43,33.12 31.89,31.66 31.89,31.15 32.78,30.26 34.9,30.26 35.11,30.47 U7.15
  Inner2 w0.254: v1(19.71,27.28) 19.71,33.12 20.01,33.43 29.68,33.43 v1(29.99,33.12)
  vias: v1(13.79,41.2) v1(13.79,40.56) v1(13.79,39.93) v1(13.79,39.3) v1(13.79,38.66) v1(13.79,38.03) v1(13.79,27.94) v1(13.79,27.31) v1(13.79,26.67) v1(13.79,26.04) v1(13.79,25.4) v1(13.79,24.77) v1(14.43,41.2) v1(14.43,40.56) v1(14.43,39.93) v1(14.43,39.3) v1(14.43,38.66) v1(14.43,38.03) v1(14.43,27.94) v1(14.43,27.31) v1(14.43,26.67) v1(14.43,26.04) v1(14.43,25.4) v1(14.43,24.77) v1(15.06,41.2) v1(15.06,40.56) v1(15.06,39.93) v1(15.06,39.3) v1(15.06,38.66) v1(15.06,38.03) v1(15.06,27.94) v1(15.06,27.31) v1(15.06,26.67) v1(15.06,26.04) v1(15.06,25.4) v1(15.06,24.77) v1(15.7,41.2) v1(15.7,40.56) v1(15.7,39.93) v1(15.7,39.3) v1(15.7,38.66) v1(15.7,38.03) v1(15.7,27.94) v1(15.7,27.31) v1(15.7,26.67) v1(15.7,26.04) v1(15.7,25.4) v1(15.7,24.77) v1(16.33,41.2) v1(16.33,40.56) v1(16.33,39.93) v1(16.33,39.3) v1(16.33,38.66) v1(16.33,38.03) v1(16.33,27.94) v1(16.33,27.31) v1(16.33,26.67) v1(16.33,26.04) v1(16.33,25.4) v1(16.33,24.77) v1(16.97,41.2) v1(16.97,40.56) v1(16.97,39.93) v1(16.97,39.3) v1(16.97,38.66) v1(16.97,38.03) v1(16.97,27.94) v1(16.97,27.31) v1(16.97,26.67) v1(16.97,26.04) v1(16.97,25.4) v1(16.97,24.77) v1(17.6,41.2) v1(17.6,40.56) v1(17.6,39.93) v1(17.6,39.3) v1(17.6,38.66) v1(17.6,38.03) v1(17.6,27.94) v1(17.6,27.31) v1(17.6,26.67) v1(17.6,26.04) v1(17.6,25.4) v1(17.6,24.77) v1(18.24,41.2) v1(18.24,40.56) v1(18.24,39.93) v1(18.24,39.3) v1(18.24,38.66) v1(18.24,38.03) v1(18.24,27.94) v1(18.24,27.31) v1(18.24,26.67) v1(18.24,26.04) v1(18.24,25.4) v1(18.24,24.77)
SH_C: length 38
  Top Layer w0.254: v1(30.63,35.36) 30.63,36.16 C43.2 31.64,36.18 31.85,35.97 31.85,32.31 32.09,32.08 U7.12 ; 8.64,26.37 8.87,26.6 R62.1 v1(12.29,27.28)
  Inner2 w0.254: v1(30.63,35.36) 30.38,35.1 12.65,35.1 12.29,34.75 v1(12.29,27.28)
  vias: v1(6.43,41.2) v1(6.43,40.56) v1(6.43,39.93) v1(6.43,39.3) v1(6.43,38.66) v1(6.43,38.03) v1(6.43,27.94) v1(6.43,27.31) v1(6.43,26.67) v1(6.43,26.04) v1(6.43,25.4) v1(6.43,24.77) v1(7.06,41.2) v1(7.06,40.56) v1(7.06,39.93) v1(7.06,39.3) v1(7.06,38.66) v1(7.06,38.03) v1(7.06,27.94) v1(7.06,27.31) v1(7.06,26.67) v1(7.06,26.04) v1(7.06,25.4) v1(7.06,24.77) v1(7.7,41.2) v1(7.7,40.56) v1(7.7,39.93) v1(7.7,39.3) v1(7.7,38.66) v1(7.7,38.03) v1(7.7,27.94) v1(7.7,27.31) v1(7.7,26.67) v1(7.7,26.04) v1(7.7,25.4) v1(7.7,24.77) v1(8.33,41.2) v1(8.33,40.56) v1(8.33,39.93) v1(8.33,39.3) v1(8.33,38.66) v1(8.33,38.03) v1(8.33,27.94) v1(8.33,27.31) v1(8.33,26.67) v1(8.33,26.04) v1(8.33,25.4) v1(8.33,24.77) v1(8.97,41.2) v1(8.97,40.56) v1(8.97,39.93) v1(8.97,39.3) v1(8.97,38.66) v1(8.97,38.03) v1(8.97,27.94) v1(8.97,27.31) v1(8.97,26.67) v1(8.97,26.04) v1(8.97,25.4) v1(8.97,24.77) v1(9.6,41.2) v1(9.6,40.56) v1(9.6,39.93) v1(9.6,39.3) v1(9.6,38.66) v1(9.6,38.03) v1(9.6,27.94) v1(9.6,27.31) v1(9.6,26.67) v1(9.6,26.04) v1(9.6,25.4) v1(9.6,24.77) v1(10.24,41.2) v1(10.24,40.56) v1(10.24,39.93) v1(10.24,39.3) v1(10.24,38.66) v1(10.24,38.03) v1(10.24,27.94) v1(10.24,27.31) v1(10.24,26.67) v1(10.24,26.04) v1(10.24,25.4) v1(10.24,24.77) v1(10.87,41.2) v1(10.87,40.56) v1(10.87,39.93) v1(10.87,39.3) v1(10.87,38.66) v1(10.87,38.03) v1(10.87,27.94) v1(10.87,27.31) v1(10.87,26.67) v1(10.87,26.04) v1(10.87,25.4) v1(10.87,24.77)
SPI1_CS: length 11.4
  Top Layer w0.152: CN5.2 38.31,10.11 arc(38.56,10.22) 38.66,10.47 38.66,17.37 37.36,18.66 U1.16
SPI1_CS1: length 15
  Top Layer w0.152: v1(25.18,18.03) 25.18,18.76 25.62,19.2 25.96,19.2 25.96,19.2 27.63,19.2 27.79,19.36 27.79,21.74 28.19,22.15 29.31,22.15 U1.38
  Bottom Layer w0.152: v1(25.18,18.03) 25.2,18.05 25.2,18.36 24.46,19.1 19.23,19.1 U16.1
SPI1_MISO: length 27.2
  Top Layer w0.152: CN5.4 36.47,11.95 v1(35.91,11.95) ; U1.14 v1(37.69,17.66)
  Inner2 w0.152: v1(35.91,11.95) 37.69,13.74 v1(37.69,17.66) 37.69,18.49 37.49,18.69 36.73,18.69 36.27,18.24 27.53,18.24 27.03,18.75 v1(26.47,18.75)
  Bottom Layer w0.152: U16.6 26.28,22.14 26.47,21.95 v1(26.47,18.75)
SPI1_MOSI: length 26.1
  Top Layer w0.152: v1(35.92,13.22) 36.49,13.22 CN5.5 ; U1.15 v1(37.21,18.16)
  Inner2 w0.152: v1(27.13,17.88) 36.47,17.88 36.76,18.16 v1(37.21,18.16) 37.24,18.13 37.24,14.54 v1(35.92,13.22)
  Bottom Layer w0.152: v1(27.13,17.88) 27.13,22.96 26.68,23.41 U16.5
SPI1_SCK: length 26.5
  Top Layer w0.152: v1(36.72,16.18) 36.72,16.86 U1.13 arc(36.42,17.17) 36.42,17.17 37.95,17.17 arc(38.23,17.05) 38.35,16.76 38.35,11.79 arc(38.23,11.49) 37.93,11.36 CN5.3
  Inner2 w0.152: v1(25.81,18.75) 25.81,17.68 26.06,17.42 36.53,17.42 36.73,17.22 36.73,16.19 v1(36.72,16.18)
  Bottom Layer w0.152: v1(25.81,18.75) 25.81,20.62 25.57,20.86 U16.7
SWCLK: length 31.5
  Top Layer w0.152: U1.37 v1(28.3,22.66)
  Inner2 w0.152: v1(28.3,22.66) 28.3,23.72 28.6,24.03 32,24.03 32.72,24.74 40.64,24.74 41,24.38 41,18.08 40.28,17.37 40.28,11.82 v1(39.83,11.36)
  Bottom Layer w0.152: CN7.4 v1(39.83,11.36)
SWDIO: length 27.3
  Top Layer w0.152: U1.36 v1(29.31,23.46)
  Inner2 w0.152: v1(29.31,23.46) 29.37,23.52 32,23.52 32.87,24.38 40.49,24.38 40.69,24.18 40.69,18.33 39.83,17.47 v1(39.83,12.61)
  Bottom Layer w0.152: CN7.3 v1(39.83,12.61)
USART3_RX: length 18.2
  Top Layer w0.152: v1(39.12,18.59) 38.3,18.59 37.9,19 37.9,22.45 37.69,22.66 U1.24
  Inner2 w0.152: v1(39.12,18.59) 39.37,18.34 39.37,9.35 38.86,8.84 v1(38.51,8.84)
  Bottom Layer w0.152: v1(38.51,8.84) 37.16,8.84 CN7.6
USART3_TX: length 15.5
  Top Layer w0.152: v1(38.91,17.88) 38.61,17.88 37.59,18.9 37.59,21.39 37.31,21.66 U1.22
  Inner2 w0.152: v1(38.91,17.88) v1(38.91,9.8)
  Bottom Layer w0.152: CN7.5 38.6,10.11 v1(38.91,9.8)
USB-DM: length 42.5
  Top Layer w0.152: U1.33 31.62,24.36 v1(31.46,24.52)
  Inner2 w0.152: v1(31.46,24.52) 31.94,24.52 32.51,25.09 40.94,25.09 41.3,24.74 41.3,17.88 40.59,17.17 40.59,8.99 39.39,7.79 39.24,7.79 38.92,8.12 38.76,8.12 38.56,7.91 38.56,7.76 38.88,7.43 38.88,7.28 38.67,7.08 38.52,7.08 38.15,7.45 38,7.45 37.79,7.24 37.79,7.09 38.16,6.72 38.16,6.56 36.93,5.33 v1(34.75,5.33)
  Bottom Layer w0.152: R15.2 31.94,3.61 34.54,3.61 34.75,3.81 v1(34.75,5.33)
USB-DP: length 42.5
  Top Layer w0.152: U1.34 31.12,24.18 v1(30.78,24.52)
  Inner2 w0.152: v1(35.25,4.83) 37.08,4.83 40.94,8.69 40.94,16.97 41.66,17.68 41.66,25.09 41.3,25.45 31.7,25.45 30.78,24.53 v1(30.78,24.52)
  Bottom Layer w0.152: v1(35.25,4.83) 35.25,2.34 35,2.08 32.77,2.08 32.59,2.25 R17.2
USB-VBUS: length 14.6
  Top Layer w0.254: USBC1.A4 29.72,7.53 v1(29.72,5.84) ; v1(34.29,5.84) 34.14,5.99 34.14,7.47 USBC1.A9
  Inner2 w0.254: v1(33.38,1.43) 32.31,1.43 31.93,1.81 31.93,5.83 v1(31.94,5.84)
  Bottom Layer w0.254: v1(29.72,5.84) v1(31.94,5.84) v1(34.29,5.84)
USB_DM: length 6.3
  Top Layer w0.254: v1(31.2,5.18) 31.21,5.19 USBC1.B7 31.21,8.71 31.39,8.89 32,8.89 32.21,8.68 USBC1.A7
  Bottom Layer w0.254: R15.1 v1(31.2,5.18)
USB_DP: length 6.4
  Top Layer w0.254: v1(32.59,5.18) 32.71,5.3 32.71,6.98 ; 32.71,6.98 USBC1.B6 32.71,6.98 ; 32.71,6.98 32.53,6.79 31.92,6.79 31.71,7 USBC1.A6
  Bottom Layer w0.254: R17.1 v1(32.59,5.18)
VB_A: length 15.3
  Top Layer w0.254: D8.1 30.81,27.86 arc(29.63,28.35) C37.1 29.81,29.53 v1(29.82,29.52) ; 37.26,32.57 v1(37.9,32.57)
  Inner2 w0.254: v1(37.9,32.57) 36.94,32.57 36.73,32.36 36.73,29.52 36.47,29.26 30.07,29.26 v1(29.82,29.52)
VB_B: length 12.7
  Top Layer w0.254: v1(36.11,29.77) 36.12,29.77 36.12,29.87 36.11,29.88 36.11,31.42 ; v1(30.68,31.98) 30.99,31.67 D9.1 30.81,31.19 arc(29.63,31.67) C40.1
  Inner2 w0.254: v1(36.11,29.77) 31.19,29.77 30.99,29.97 30.99,31.68 v1(30.68,31.98)
VB_C: length 16.1
  Top Layer w0.254: 34.61,31.42 34.61,31 34.4,30.79 33.07,30.79 32.77,31.09 32.77,31.39 ; v1(31.29,35.36) 31.29,34.82 D10.1 30.81,34.51 arc(29.63,35) C43.1
  Inner2 w0.254: v1(32.77,31.44) 32.77,31.09 33.07,30.78 34.19,30.78 34.39,30.99 34.39,35.15 34.19,35.36 v1(31.29,35.36)
WS2812: length 29.6
  Top Layer w0.152: LED1.2 25.9,4.03 25.71,4.22 24.03,4.22 23.72,4.52 23.72,7.31 v1(23.37,7.67) ; U1.12 35.82,16.57 v1(36.12,16.57)
  Inner2 w0.152: v1(36.12,16.57) 28.35,16.57 28.09,16.31 28.09,13.41 27.84,13.16 23.11,13.16 22.91,12.95 22.91,12.24 v1(23.16,11.99)
  Bottom Layer w0.152: v1(23.16,11.99) 22.91,11.74 22.91,8.12 v1(23.37,7.67)
$1N2033: length 3.6
  Top Layer w0.254: v1(33.99,5.18) 33.71,5.47 USBC1.B5
  Bottom Layer w0.254: R14.2 v1(33.99,5.18)
$1N2034: length 3.9
  Top Layer w0.254: v1(29.8,5.18) 30.71,6.09 USBC1.A5
  Bottom Layer w0.254: R16.1 v1(29.8,5.18)
$1N2854: length 1.4
  Top Layer w0.254: v1(19.68,1.02) L3.1
  Bottom Layer w0.254: 19.01,1.02 v1(19.68,1.02)
$1N3499: length 1.4
  Top Layer w0.254: L4.1 v1(16.21,1.02)
  Bottom Layer w0.254: R92.2 v1(16.21,1.02)
$1N16031: length 7.5
  Top Layer w0.152: U12.4 9.62,10.28 arc(9.61,10.28) 9.6,10.26 arc(9.31,10.14) 9.19,9.86 9.19,9.3 arc(9.1,9.08) 8.89,8.99 8.47,8.99 arc(7.94,9.21) 7.72,9.74 7.72,11.9 arc(7.94,12.43) 8.47,12.65
$1N16145: length 8.8
  Top Layer w0.152: v1(9.8,8.79) 10.43,8.79 arc(10.57,8.85) 10.63,8.99 arc(10.91,9.11) 11.02,9.39 11.02,11.33 arc(11.11,11.54) 11.33,11.63 12.09,11.63 arc(12.26,11.7) 12.33,11.87 U12.1 ; R20.1 7.42,8.99 arc(7.56,8.93) v1(7.62,8.79)
  Inner2 w0.152: v1(7.62,8.79) v1(9.8,8.79)
$1N16800: length 7.2
  Top Layer w0.152: U13.4 arc(17.27,10.23) 17.22,10.21 16.71,10.21 arc(16.39,10.08) 16.26,9.75 16.26,9.25 arc(16.18,9.06) 16,8.99 15.59,8.99 arc(15.05,9.21) 14.83,9.74 14.83,11.9 arc(15.05,12.43) 15.59,12.65
$1N16806: length 8
  Top Layer w0.152: R21.1 14.43,8.99 arc(14.64,8.9) v1(14.73,8.69)
  Top Layer w0.254: 19.19,12.58 19.19,11.92 18.49,11.23 18.49,10.06 17.12,8.69 v1(16.51,8.69)
  Inner2 w0.152: v1(14.73,8.69) v1(16.51,8.69)
$1N17179: length 7.4
  Top Layer w0.152: R74.2 22.15,12.65 arc(21.79,12.5) 21.64,12.14 21.64,9.69 arc(21.85,9.2) R33.2 22.81,8.99 arc(22.95,9.05) 23.01,9.19 23.01,9.8 arc(23.15,10.13) 23.47,10.26 24.18,10.26 arc(24.19,10.27) U14.4
$1N17185: length 8.3
  Top Layer w0.152: v1(21.44,8.58) 21.24,8.58 21.09,8.74 arc(20.91,8.81) R33.1 ; v1(23.37,8.58) 23.99,8.58 24.14,8.74 arc(24.32,8.81) 24.39,8.99
  Top Layer w0.254: U14.1 26.11,12.56 26.11,11.48 25.55,10.92 25.55,10.15 24.39,8.99
  Inner2 w0.152: v1(23.37,8.58) v1(21.44,8.58)
$1N44641: length 4.2
  Top Layer w0.152: 8.47,10.21 8.47,11.43 10.11,11.43 arc(10.32,11.52) 10.41,11.73 10.41,12.56 arc(10.42,12.57) U12.3
$1N44863: length 4.1
  Top Layer w0.152: 22.34,10.21 R75.2 23.82,11.43 arc(24.11,11.55) 24.23,11.84 24.23,12.54 arc(24.22,12.57) U14.3
$1N45012: length 4
  Top Layer w0.152: 15.59,10.21 15.59,11.43 17.07,11.43 arc(17.25,11.5) 17.32,11.68 17.32,12.54 arc(17.31,12.57) U13.3
$1N45449: length 10.4
  Top Layer w0.254: R80.1 v1(23.05,2.31) 23.06,2.31
  Top Layer w0.305: v1(23.05,2.31) 23.27,2.53 23.27,6.71 23.01,6.96 20.84,6.96 20.64,6.76 ; 20.64,6.76 U17.3 ; 20.64,6.76 20.64,7.53 C54.2
  Bottom Layer w0.254: R80.1 23.01,2.31
$1N49622: length 9.3
  Top Layer w0.254: 11.48,30.63 11.48,33.86 D11.2 ; 11.48,30.63 11.48,29.82 ; 11.48,30.63 11.07,30.22 10.54,30.22 ; 11.48,29.82 11.48,28.92 R62.2 ; 11.48,29.82 11.85,29.45 R59.2
$1N53821: length 6.8
  Top Layer w0.254: R82.2 18.39,21.22 R81.2 18.39,22.35 17.91,22.83 19.66,24.58 19.66,25.18
$1N53957: length 6.8
  Top Layer w0.254: 27.03,25.18 27.03,24.58 25.27,22.83 25.76,22.35 R83.2 25.76,21.22 27.08,19.9
$1N54089: length 9.3
  Top Layer w0.254: 19.66,28.11 18.85,28.92 18.85,29.82 ; 18.85,30.63 18.85,33.86 19.66,34.68 ; 18.85,30.63 18.44,30.22 17.91,30.22 ; 18.85,30.63 18.85,29.82 ; 19.66,29.45 19.22,29.45 18.85,29.82
$1N54225: length 9.3
  Top Layer w0.254: 26.21,30.63 26.21,29.82 ; 26.21,30.63 25.8,30.22 25.27,30.22 ; 26.21,30.63 26.21,33.86 27.03,34.68 ; 26.21,29.82 26.58,29.45 27.03,29.45 ; 26.21,29.82 26.21,28.92 27.03,28.11
$1N55157: length 1.4
  Top Layer w0.254: R90.2 12.33,7.53 U4.4
$1N55174: length 5.3
  Top Layer w0.254: C4.2 v1(6.2,5.74) ; v1(9.45,5.74) 9.79,5.74 U4.6
  Inner2 w0.254: v1(6.2,5.74) v1(9.45,5.74)
$1N55720: length 1.4
  Top Layer w0.254: v1(26.6,1.02) 25.95,1.02 25.9,1.07
  Bottom Layer w0.254: 25.93,1.07 25.98,1.02 v1(26.6,1.02)
$1N55724: length 1.4
  Top Layer w0.254: v1(23.05,0.97) 22.39,0.97 R94.2
  Bottom Layer w0.254: v1(23.05,0.97) 22.43,0.97 22.38,1.02
$1N81384: length 6.8
  Top Layer w0.254: R68.2 11.02,21.22 R67.2 11.02,22.35 10.54,22.83 12.29,24.58 D14.2

## Copper pours and planes (outline as drawn; the poured copper is in the pictures)
5V on Top Layer: 5.64,4.93 7.26,4.93 7.26,0.51 5.64,0.51
12V on Top Layer: -1.27,36.68 5.64,36.68 5.64,5.39 2.88,5.39 2.88,22.02 3.94,22.02 3.94,29.67 -1.27,29.67
12V on Top Layer: 10.87,5.79 11.74,5.79 11.74,7.08 11.48,7.08 11.48,8.28 8.28,8.28 8.28,6.43 9.75,6.43 9.75,7.08 10.87,7.08
12V on Top Layer: -1.27,36.68 5.64,36.68 5.64,5.39 2.88,5.39 2.88,22.02 3.94,22.02 3.94,29.67 -1.27,29.67
12V on Top Layer: 24.84,18.24 27.37,18.24 27.37,17.54 27.38,17.47 27.38,15.95 24.84,15.95
12V on Top Layer: 17.53,18.64 20.57,18.64 20.57,15.9 17.53,15.9
12V on Top Layer: 10.16,18.64 13.21,18.64 13.21,15.9 10.16,15.9
12V on Top Layer: 10.97,30.96 10.97,34.3 13.61,34.3 13.61,31.42 18.4,31.42 18.4,34.3 20.98,34.3 20.98,31.42 25.74,31.42 25.74,34.37 27.63,34.37 27.63,35.67 26.05,35.67 26.05,42.85 -1.75,42.85 -1.75,30.96
12V on Bottom Layer: -1.27,36.68 5.64,36.68 5.64,5.39 2.88,5.39 2.88,22.02 3.94,22.02 3.94,29.67 -1.27,29.67
12V on Bottom Layer: 2.88,15.93 2.88,18.62 7.31,18.62 7.31,17.22 8.64,17.22 8.64,18.64 14.68,18.64 14.68,17.22 16.03,17.22 16.03,18.64 22.05,18.64 22.05,17.17 23.35,17.17 23.35,18.23 26.62,18.23 26.62,17.47 27.37,17.47 27.37,15.93
12V on Inner2: 10.16,7.11 3.5,7.11 3.5,5.54 2.88,5.54 2.88,13.11 3.5,13.11 3.5,8.28 10.16,8.28
GND on Top Layer: -6.71,46.84 46.99,46.84 46.99,-4.37 -6.71,-4.37
GND on Bottom Layer: -6.71,46.84 46.99,46.84 46.99,-4.37 -6.71,-4.37
GND on Inner1: -6.71,46.84 46.99,46.84 46.99,-4.37 -6.71,-4.37
GND on Inner2: -6.71,46.84 46.99,46.84 46.99,-4.37 -6.71,-4.37
PGND on Top Layer: -2.59,44.5 44.04,44.5 44.04,30.94 36.42,30.94 36.42,29.52 31.57,29.52 31.57,26.75 29.92,26.75 29.92,25.55 27.63,25.55 27.63,19.41 27.43,19.15 27.43,13.36 5.69,13.36 5.69,8.37 13.26,8.37 13.26,-1.17 -2.69,-1.17 -2.69,44.4
PGND on Top Layer: 9.7,0.51 9.7,1.68 11.38,1.68 11.38,2.69 11.74,3.05 11.74,4.16 10.9,4.16 10.9,3.03 10.77,2.9 9.48,2.9 9.48,2.49 8.68,2.49 8.68,0.51
PGND on Bottom Layer: -2.59,44.5 44.04,44.5 44.04,30.94 36.42,30.94 36.42,29.52 31.57,29.52 31.57,26.75 29.92,26.75 29.92,25.55 27.63,25.55 27.63,19.41 27.43,19.15 27.43,13.36 5.69,13.36 5.69,8.37 13.26,8.37 13.26,-1.17 -2.69,-1.17 -2.69,44.4
PGND on Bottom Layer: 5.92,15.77 5.92,13.36 27.38,13.36 27.38,15.77
